# Altium project zed-80.PrjPcb
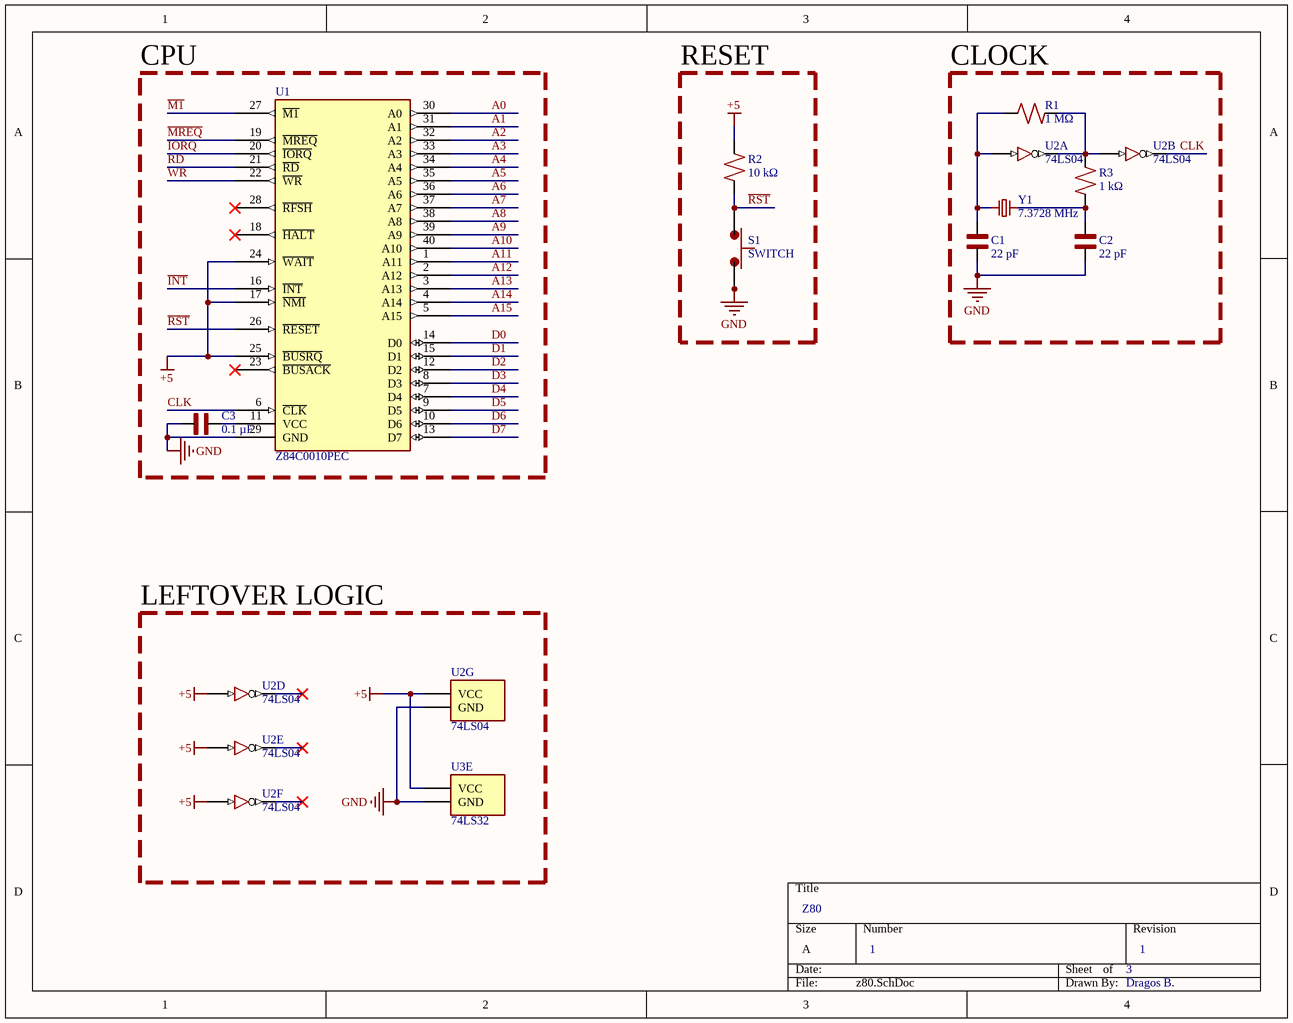
[diagram p0: z80.SchDoc]
3 sheets, 25 parts. Net scope: global (net labels, ports and power ports of the same name join across sheets).
Board file: pcb.PcbDoc
Sheets:
  z80.SchDoc
  memory.SchDoc
  uart.SchDoc

## Sheet z80.SchDoc
size A; SheetNumber: 1; SheetTotal: 3

### Parts
C1  22 pF  [Capacitor]
C2  22 pF  [Capacitor]
C3  0.1 µF  [Capacitor]
R1  1 MΩ  [Axial 0.4]
R2  10 kΩ  [Axial 0.4]
R3  1 kΩ  [Axial 0.4]
S1  SWITCH  [SW_PTS645SL43SMTR92LFS]
U1  Z84C0010PEC  [DIP40]
U2  74LS04  [DIP14]  (parts A,B,D,E,F,G of 7)
U3  74LS32  [DIP14]  (part E of 5)
Y1  7.3728 MHz  [HC49S]

### Blocks framed on the sheet
CPU: C3 U1
RESET: R2 S1
CLOCK: C1 C2 R1 R3 U2 Y1
LEFTOVER LOGIC: U2 U3

### Nets
+5: R2.2 U1.17(~{NMI}) U1.24(~{WAIT}) U1.25(~{BUSRQ}) U2.9(A4) U2.11(A5) U2.13(A6) U2.14(VCC) U3.14(VCC)
GND: C1.1 C2.1 C3.2 S1.3 S1.4 U1.29(GND) U2.7(GND) U3.7(GND)
~{INT}: U1.16(~{INT})
~{IORQ}: U1.20(~{IORQ})
~{M1}: U1.27(~{M1})
~{MREQ}: U1.19(~{MREQ})
~{RD}: U1.21(~{RD})
~{RST}: R2.1 S1.1 S1.2 U1.26(~{RESET})
~{WR}: U1.22(~{WR})
A0: U1.30(A0)
A1: U1.31(A1)
A2: U1.32(A2)
A3: U1.33(A3)
A4: U1.34(A4)
A5: U1.35(A5)
A6: U1.36(A6)
A7: U1.37(A7)
A8: U1.38(A8)
A9: U1.39(A9)
A10: U1.40(A10)
A11: U1.1(A11)
A12: U1.2(A12)
A13: U1.3(A13)
A14: U1.4(A14)
A15: U1.5(A15)
CLK: U1.6(~{CLK}) U2.4(Y2)
D0: U1.14(D0)
D1: U1.15(D1)
D2: U1.12(D2)
D3: U1.8(D3)
D4: U1.7(D4)
D5: U1.9(D5)
D6: U1.10(D6)
D7: U1.13(D7)
NetC1_2: C1.2 R1.2 U2.1(A1) Y1.1
NetC2_2: C2.2 R3.1 Y1.2
NetC3_1: C3.1 U1.11(VCC)
NetR1_1: R1.1 R3.2 U2.2(A2) U2.3(A2)

Not connected (* = marked no-connect by the designer): U1 18(~{HALT})* 23(~{BUSACK})* 28(~{RFSH})*; U2 8(Y4)* 10(Y5)* 12(Y6)*

### Notes on the sheet
- Z80
- 1
- 3
- Dragos B.

### Library data of the parts
C1-C3 = CAPACITOR: MP: ECWFG70105K; MF: Panasonic; SnapEDA_Link: https://www.snapeda.com/parts/ECWFG70105K/Panasonic/view-part/?ref=snap; Availability: In Stock; Price: None; Check_prices: https://www.snapeda.com/parts/ECWFG70105K/Panasonic/view-part/?ref=eda; Value: *; Purchase-URL: https://pricing.snapeda.com/search/part/ECWFG70105K/?ref=eda; Package: MOLDED-2 Panasonic
R1-R3 = RESISTOR: MP: ERJU01J131C; Package: None; Availability: Unavailable; Value: *; Price: None
S1 = SWITCH: MF: ALPS; MP: SKRPABE010; SnapEDA_Link: https://www.snapeda.com/parts/SKRPABE010/ALPS/view-part/?ref=snap; Package: None; Value: *; Check_prices: https://www.snapeda.com/parts/SKRPABE010/ALPS/view-part/?ref=eda
U2 = 74LS04: Hex Inverters
Y1 = CRYSTAL: MF: IQD Frequency Products; MP: LFXTAL003056B; SnapEDA_Link: https://www.snapeda.com/parts/LFXTAL003056B/IQD+Frequency+Products/view-part/?ref=snap; Package: None; Value: *; Check_prices: https://www.snapeda.com/parts/LFXTAL003056B/IQD+Frequency+Products/view-part/?ref=eda

## Sheet memory.SchDoc
size A; SheetNumber: 2; SheetTotal: 3
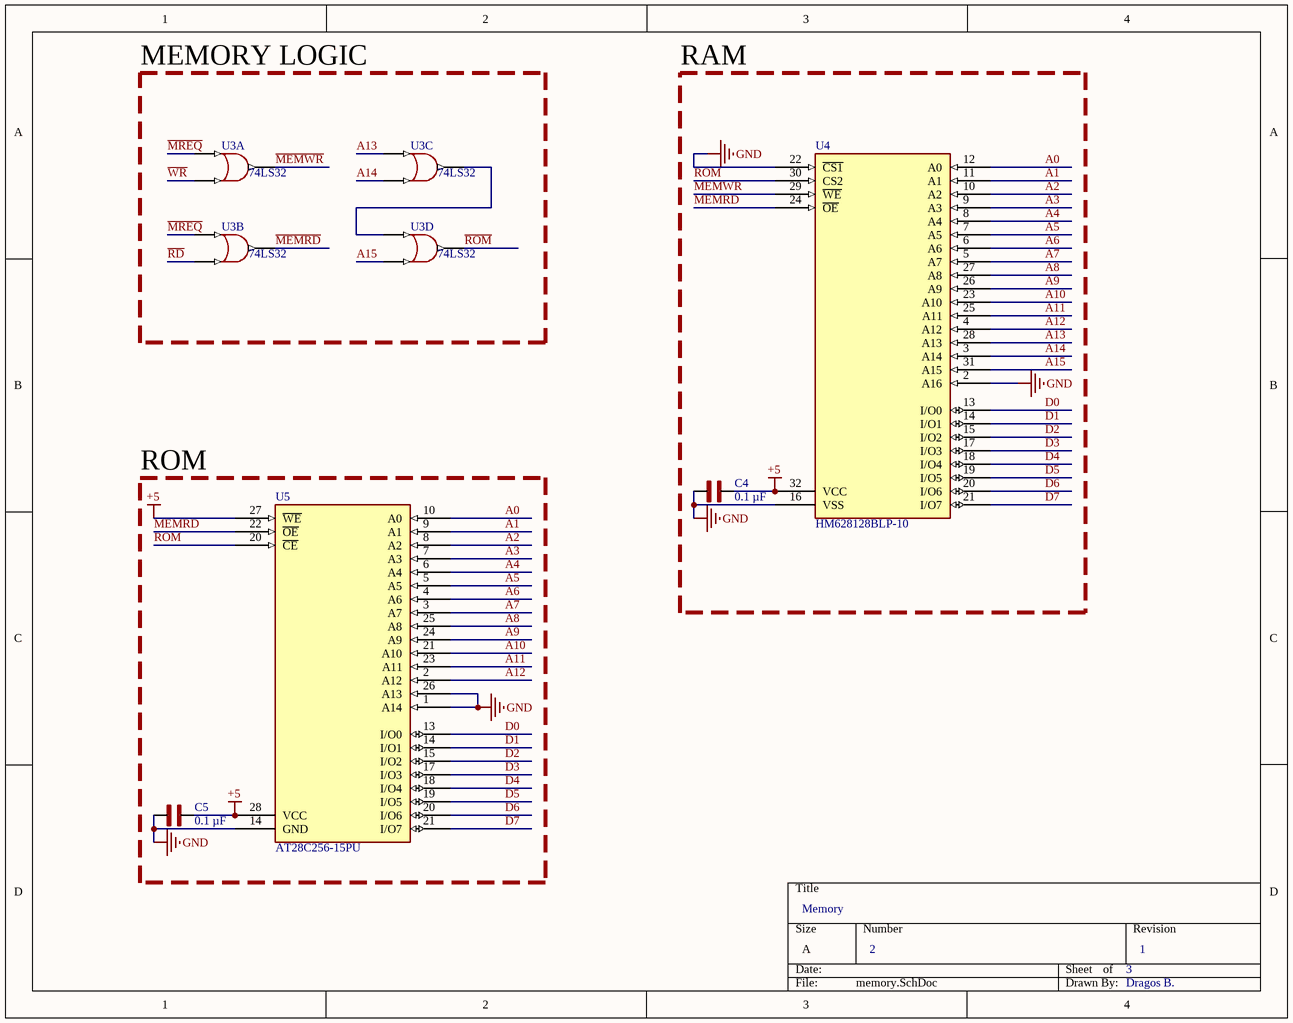
[diagram p1: memory.SchDoc]

### Parts
C4  0.1 µF  [Capacitor]
C5  0.1 µF  [Capacitor]
U3  74LS32  [DIP14]  (parts A,B,C,D of 5)
U4  HM628128BLP-10  [DIP32]
U5  AT28C256-15PU  [DIP28]

### Blocks framed on the sheet
MEMORY LOGIC: U3
RAM: C4 U4
ROM: C5 U5

### Nets
+5: C4.2 C5.2 U4.32(VCC) U5.27(~{WE}) U5.28(VCC)
GND: C4.1 C5.1 U4.2(A16) U4.16(VSS) U4.22(~{CS1}) U5.1(A14) U5.14(GND) U5.26(A13)
~{MEMRD}: U3.6(Y2) U4.24(~{OE}) U5.22(~{OE})
~{MEMWR}: U3.3(Y1) U4.29(~{WE})
~{MREQ}: U3.1(A1) U3.4(A2)
~{RD}: U3.5(B2)
~{ROM}: U3.11(Y4) U4.30(CS2) U5.20(~{CE})
~{WR}: U3.2(B1)
A0: U4.12(A0) U5.10(A0)
A1: U4.11(A1) U5.9(A1)
A2: U4.10(A2) U5.8(A2)
A3: U4.9(A3) U5.7(A3)
A4: U4.8(A4) U5.6(A4)
A5: U4.7(A5) U5.5(A5)
A6: U4.6(A6) U5.4(A6)
A7: U4.5(A7) U5.3(A7)
A8: U4.27(A8) U5.25(A8)
A9: U4.26(A9) U5.24(A9)
A10: U4.23(A10) U5.21(A10)
A11: U4.25(A11) U5.23(A11)
A12: U4.4(A12) U5.2(A12)
A13: U3.9(A3) U4.28(A13)
A14: U3.10(B3) U4.3(A14)
A15: U3.13(B4) U4.31(A15)
D0: U4.13(I/O0) U5.13(I/O0)
D1: U4.14(I/O1) U5.14(I/O1)
D2: U4.15(I/O2) U5.15(I/O2)
D3: U4.17(I/O3) U5.17(I/O3)
D4: U4.18(I/O4) U5.18(I/O4)
D5: U4.19(I/O5) U5.19(I/O5)
D6: U4.20(I/O6) U5.20(I/O6)
D7: U4.21(I/O7) U5.21(I/O7)
NetU3_8: U3.8(Y3) U3.12(A4)

### Notes on the sheet
- Memory
- 2
- 3
- 1
- Dragos B.

### Library data of the parts
C4 C5 = CAPACITOR: MP: ECWFG70105K; MF: Panasonic; SnapEDA_Link: https://www.snapeda.com/parts/ECWFG70105K/Panasonic/view-part/?ref=snap; Availability: In Stock; Price: None; Check_prices: https://www.snapeda.com/parts/ECWFG70105K/Panasonic/view-part/?ref=eda; Value: *; Purchase-URL: https://pricing.snapeda.com/search/part/ECWFG70105K/?ref=eda; Package: MOLDED-2 Panasonic

## Sheet uart.SchDoc
size A; SheetNumber: 3; SheetTotal: 3
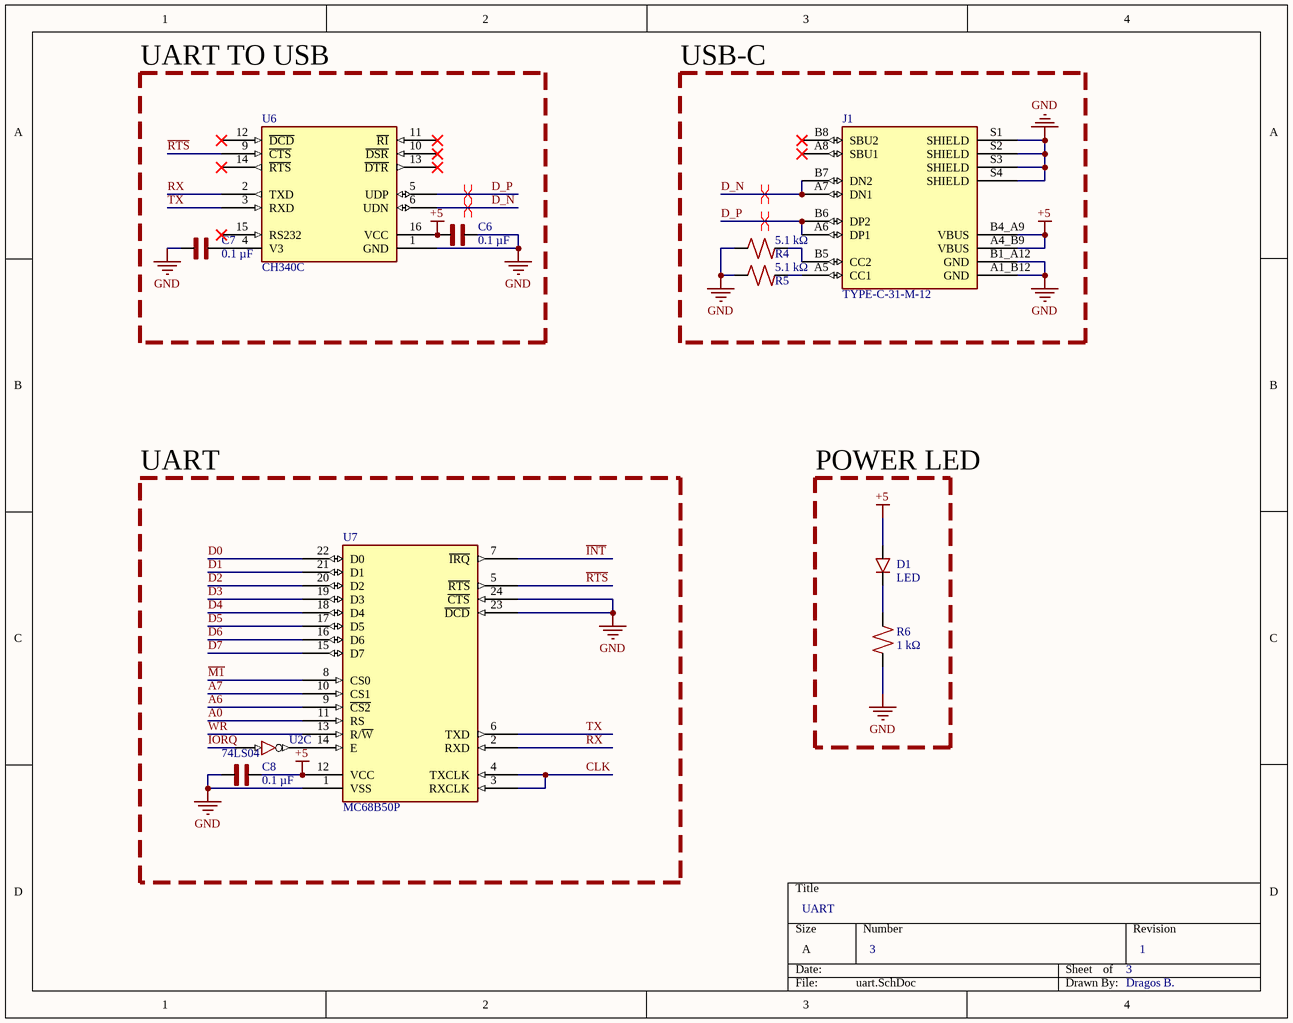
[diagram p2: uart.SchDoc]

### Parts
C6  0.1 µF  [Capacitor]
C7  0.1 µF  [Capacitor]
C8  0.1 µF  [Capacitor]
D1  LED  [DIODE]
J1  TYPE-C-31-M-12  [HRO_TYPE-C-31-M-12]
R4  5.1 kΩ  [Axial 0.4]
R5  5.1 kΩ  [Axial 0.4]
R6  1 kΩ  [Axial 0.4]
U2  74LS04  [DIP14]  (part C of 7)
U6  CH340C  [SOP127P600X175-16M]
U7  MC68B50P  [DIP24]

### Blocks framed on the sheet
UART TO USB: C6 C7 U6
USB-C: J1 R4 R5
UART: C8 U2 U7
POWER LED: D1 R6

### Nets
+5: C6.2 C8.1 D1.A J1.A4_B9(VBUS) J1.B4_A9(VBUS) U6.16(VCC) U7.12(VCC)
GND: C6.1 C7.2 C8.2 J1.A1_B12(GND) J1.B1_A12(GND) J1.S1(SHIELD) J1.S2(SHIELD) J1.S3(SHIELD) J1.S4(SHIELD) R4.1 R5.1 R6.1 U6.1(GND) U7.1(VSS) U7.23(~{DCD}) U7.24(~{CTS})
~{INT}: U7.7(~{IRQ})
~{IORQ}: U2.5(A3)
~{M1}: U7.8(CS0)
~{RTS}: U6.9(~{CTS}) U7.5(~{RTS})
~{WR}: U7.13(R/~{W})
A0: U7.11(RS)
A6: U7.9(~{CS2})
A7: U7.10(CS1)
CLK: U7.3(RXCLK) U7.4(TXCLK)
D0: U7.22(D0)
D1: U7.21(D1)
D2: U7.20(D2)
D3: U7.19(D3)
D4: U7.18(D4)
D5: U7.17(D5)
D6: U7.16(D6)
D7: U7.15(D7)
D_N: J1.A7(DN1) J1.B7(DN2) U6.6(UDN)
D_P: J1.A6(DP1) J1.B6(DP2) U6.5(UDP)
RX: U6.2(TXD) U7.2(RXD)
TX: U6.3(RXD) U7.6(TXD)
NetC7_1: C7.1 U6.4(V3)
NetD1_K: D1.K R6.2
NetJ1_A5: J1.A5(CC1) R5.2
NetJ1_B5: J1.B5(CC2) R4.2
NetU2_6: U2.6(Y3) U7.14(E)

Not connected (* = marked no-connect by the designer): J1 A8(SBU1)* B8(SBU2)*; U6 10(~{DSR})* 11(~{RI})* 12(~{DCD})* 13(~{DTR})* 14(~{RTS})* 15(RS232)*

### Layout directives
differential pair: D_N, D_P

### Notes on the sheet
- UART
- 3
- 1
- Dragos B.

### Library data of the parts
C6-C8 = CAPACITOR: MP: ECWFG70105K; MF: Panasonic; SnapEDA_Link: https://www.snapeda.com/parts/ECWFG70105K/Panasonic/view-part/?ref=snap; Availability: In Stock; Price: None; Check_prices: https://www.snapeda.com/parts/ECWFG70105K/Panasonic/view-part/?ref=eda; Value: *; Purchase-URL: https://pricing.snapeda.com/search/part/ECWFG70105K/?ref=eda; Package: MOLDED-2 Panasonic
J1 = TYPE-C-31-M-12: MF: HRO Electronics Co., Ltd.; SnapEDA_Link: https://www.snapeda.com/parts/TYPE-C-31-M-12/HRO+Electronics+Co.%252C+Ltd./view-part/?ref=snap; Package: Package; Value: *; MP: TYPE-C-31-M-12; Check_prices: https://www.snapeda.com/parts/TYPE-C-31-M-12/HRO+Electronics+Co.%252C+Ltd./view-part/?ref=eda
R4-R6 = RESISTOR: MP: ERJU01J131C; Package: None; Availability: Unavailable; Value: *; Price: None
U2 = 74LS04: Hex Inverters

## Nets that join several sheets
+5: z80 (9 pins), memory (5 pins), uart (7 pins)
GND: z80 (8 pins), memory (8 pins), uart (16 pins)
~{INT}: z80 (U1.16), uart (U7.7)
~{IORQ}: z80 (U1.20), uart (U2.5)
~{M1}: z80 (U1.27), uart (U7.8)
~{MREQ}: z80 (U1.19), memory (U3.1 U3.4)
~{RD}: z80 (U1.21), memory (U3.5)
~{WR}: z80 (U1.22), memory (U3.2), uart (U7.13)
A0: z80 (U1.30), memory (U4.12 U5.10), uart (U7.11)
A1: z80 (U1.31), memory (U4.11 U5.9)
A2: z80 (U1.32), memory (U4.10 U5.8)
A3: z80 (U1.33), memory (U4.9 U5.7)
A4: z80 (U1.34), memory (U4.8 U5.6)
A5: z80 (U1.35), memory (U4.7 U5.5)
A6: z80 (U1.36), memory (U4.6 U5.4), uart (U7.9)
A7: z80 (U1.37), memory (U4.5 U5.3), uart (U7.10)
A8: z80 (U1.38), memory (U4.27 U5.25)
A9: z80 (U1.39), memory (U4.26 U5.24)
A10: z80 (U1.40), memory (U4.23 U5.21)
A11: z80 (U1.1), memory (U4.25 U5.23)
A12: z80 (U1.2), memory (U4.4 U5.2)
A13: z80 (U1.3), memory (U3.9 U4.28)
A14: z80 (U1.4), memory (U3.10 U4.3)
A15: z80 (U1.5), memory (U3.13 U4.31)
CLK: z80 (U1.6 U2.4), uart (U7.3 U7.4)
D0: z80 (U1.14), memory (U4.13 U5.13), uart (U7.22)
D1: z80 (U1.15), memory (U4.14 U5.14), uart (U7.21)
D2: z80 (U1.12), memory (U4.15 U5.15), uart (U7.20)
D3: z80 (U1.8), memory (U4.17 U5.17), uart (U7.19)
D4: z80 (U1.7), memory (U4.18 U5.18), uart (U7.18)
D5: z80 (U1.9), memory (U4.19 U5.19), uart (U7.17)
D6: z80 (U1.10), memory (U4.20 U5.20), uart (U7.16)
D7: z80 (U1.13), memory (U4.21 U5.21), uart (U7.15)